# Altium schematic sheet 1_Sheet_1.schdoc.schdoc
size 426 x 302 mm; Name: A_A3; Symbol: A_A3; Device: A_A3; @Project Name: 树莓派3/4B UPS电源; REV: 1.0; Date: 2024-3-5; Sheet: 1/1; Draw By: Sitcom; Company: Your Company; Convert to PCB: yes; Add into BOM: yes
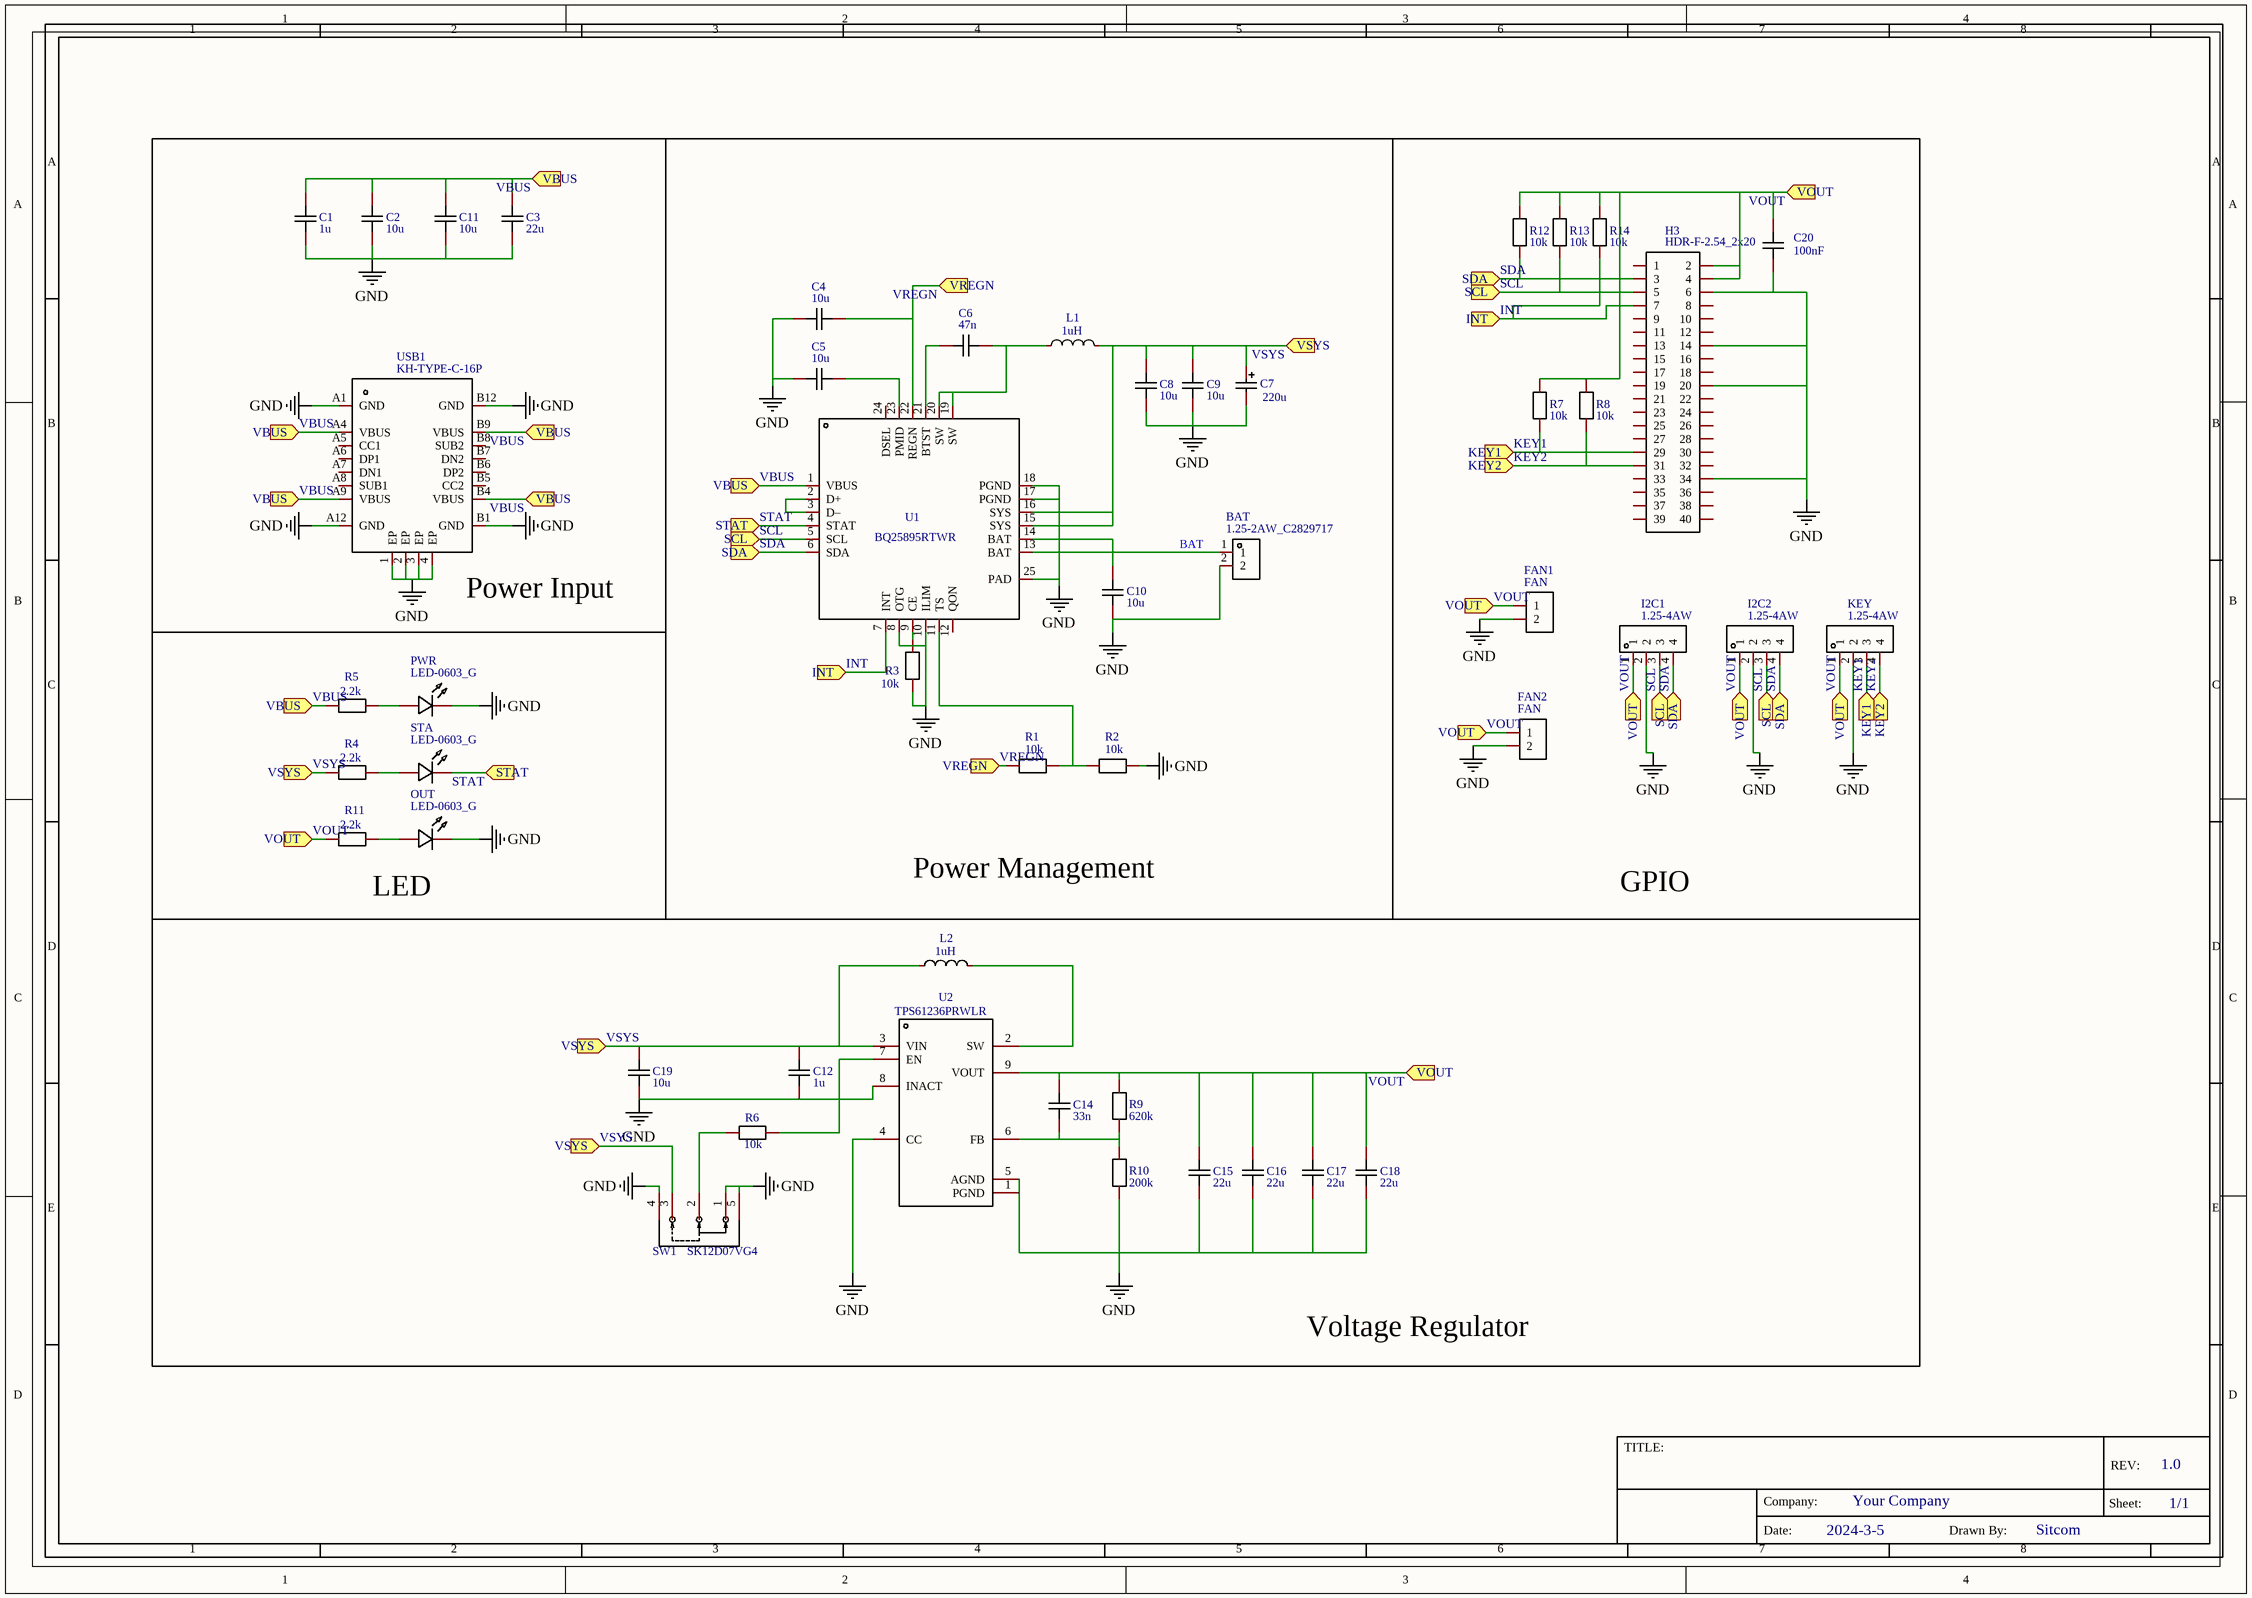
[diagram p0: 1_Sheet_1.schdoc.schdoc]

## Parts
BAT  1.25-2AW_C2829717  [CONN-TH_1.25-2AW_C2829717]
C1  1u  [C0603]
C2  10u  [C0603]
C3  22u  [C0603]
C4  10u  [C0603]
C5  10u  [C0603]
C6  47n  [C0603]
C7  220u  [CAP-SMD_L3.5-W2.8-R-RD]
C8  10u  [C0603]
C9  10u  [C0603]
C10  10u  [C0603]
C11  10u  [C0603]
C12  1u  [C0603]
C14  33n  [C0603]
C15  22u  [C0603]
C16  22u  [C0603]
C17  22u  [C0603]
C18  22u  [C0603]
C19  10u  [C0603]
C20  100nF  [C0603]
FAN1  FAN  [HDR-F-2.54_1X2]
FAN2  FAN  [HDR-F-2.54_1X2]
H3  HDR-F-2.54_2x20  [HDR-F-2.54_2X20]
I2C1  1.25-4AW  [CONN-TH_1.25-4AW]
I2C2  1.25-4AW  [CONN-TH_1.25-4AW]
KEY  1.25-4AW  [CONN-TH_1.25-4AW]
L1  1uH  [IND-SMD_L7.0-W6.6_MPCA-0630]
L2  1uH  [IND-SMD_L7.0-W6.6_MPCA-0630]
OUT  LED-0603_G  [LED0603_GREEN]
PWR  LED-0603_G  [LED0603_GREEN]
R1  10k  [R0603]
R2  10k  [R0603]
R3  10k  [R0603]
R4  2.2k  [R0603]
R5  2.2k  [R0603]
R6  10k  [R0603]
R7  10k  [R0603]
R8  10k  [R0603]
R9  620k  [R0603]
R10  200k  [R0603]
R11  2.2k  [R0603]
R12  10k  [R0603]
R13  10k  [R0603]
R14  10k  [R0603]
STA  LED-0603_G  [LED0603_GREEN]
SW1  SK12D07VG4  [SW-TH_SK12D07VG4]
U1  BQ25895RTWR  [QFN-24_L4.0-W4.0-P0.50-TL-EP2.7]
U2  TPS61236PRWLR  [VQFN-9_L2.5-W2.5-P0.50-TL]
USB1  KH-TYPE-C-16P  [USB-C-SMD_KH-TYPE-C-16P]

## Blocks framed on the sheet
Power Input: C1-C3 C11 USB1
Power Management: BAT C4-C10 L1 R1-R3 U1
GPIO: C20 FAN1 FAN2 H3 I2C1 I2C2 KEY R7 R8 R12-R14
LED: OUT PWR R4 R5 R11 STA
Voltage Regulator: C12 C14-C19 L2 R6 R9 R10 SW1 U2

## Ports
INT (in), KEY1 (in), KEY2 (in), SCL (in), SDA (in), STAT (in), VBUS (in), VOUT (in), VREGN (in), VSYS (in)

## Nets
GND: BAT.2 C1.1 C2.1 C3.1 C4.2 C5.2 C7.2 C8.1 C9.1 C10.1 C11.1 C12.1 C15.1 C16.1 C17.1 C18.1 C19.1 C20.1 FAN1.2 FAN2.2 H3.6 H3.14 H3.20 H3.34 I2C1.2 I2C2.2 KEY.2 OUT.2 PWR.2 R2.2 R3.2 R10.1 SW1.1 SW1.4 SW1.5 U1.8(OTG) U1.10(ILIM) U1.17(PGND) U1.18(PGND) U1.25(PAD) U2.1(PGND) U2.4(CC) U2.5(AGND) U2.8(INACT) USB1.1(EP) USB1.2(EP) USB1.3(EP) USB1.4(EP) USB1.A1(GND) USB1.A12(GND) USB1.B1(GND) USB1.B12(GND)
BAT: BAT.1 C10.2 U1.13(BAT) U1.14(BAT)
INT: H3.7 R14.1 U1.7(INT) ; port INT
KEY1: H3.29 KEY.3 R7.1 ; port KEY1
KEY2: H3.31 KEY.4 R8.1 ; port KEY2
SCL: H3.5 I2C1.3 I2C2.3 R13.1 U1.5(SCL) ; port SCL
SDA: H3.3 I2C1.4 I2C2.4 R12.1 U1.6(SDA) ; port SDA
STAT: STA.2 U1.4(STAT) ; port STAT
VBUS: C1.2 C2.2 C3.2 C11.2 R5.1 U1.1(VBUS) USB1.A4(VBUS) USB1.A9(VBUS) USB1.B4(VBUS) USB1.B9(VBUS) ; port VBUS
VOUT: C14.2 C15.2 C16.2 C17.2 C18.2 C20.2 FAN1.1 FAN2.1 H3.2 H3.4 I2C1.1 I2C2.1 KEY.1 R7.2 R8.2 R9.2 R11.1 R12.2 R13.2 R14.2 U2.9(VOUT) ; port VOUT
VREGN: C4.1 R1.1 U1.22(REGN) ; port VREGN
VSYS: C7.1 C8.2 C9.2 C12.2 C19.2 L1.2 L2.1 R4.1 SW1.3 U1.15(SYS) U1.16(SYS) U2.3(VIN) ; port VSYS
NetC5_1: C5.1 U1.23(PMID)
NetC6_1: C6.1 U1.21(BTST)
NetC6_2: C6.2 L1.1 U1.19(SW) U1.20(SW)
NetC14_1: C14.1 R9.1 R10.2 U2.6(FB)
NetL2_2: L2.2 U2.2(SW)
NetOUT_1: OUT.1 R11.2
NetPWR_1: PWR.1 R5.2
NetR1_2: R1.2 R2.1 U1.11(TS)
NetR3_1: R3.1 U1.9(CE)
NetR4_2: R4.2 STA.1
NetR6_1: R6.1 SW1.2
NetR6_2: R6.2 U2.7(EN)
NetU1_2: U1.2(D+) U1.3(D–)

Not connected (* = marked no-connect by the designer): H3 1 8 9 10 11 12 13 15 16 17 18 19 21 22 23 24 25 26 27 28 30 32 33 35 36 37 38 39 40; U1 12(QON) 24(DSEL); USB1 A5(CC1) A6(DP1) A7(DN1) A8(SUB1) B5(CC2) B6(DP2) B7(DN2) B8(SUB2)

## Notes on the sheet
- 1
- 2
- 3
- 4
- 5
- 6
- 7
- 8
- A
- B
- C
- D
- E
- TITLE:
- REV:
- 1.0
- Date:
- Company:
- 2024-3-5
- Your Company
- Drawn By:
- Sitcom
- Sheet:
- 1/1

## Library data of the parts
BAT = 1.25-2AW: Manufacturer: FG(富港); Convert to PCB: yes; Name: 1.25-2AW_C2829717; Symbol: 1.25-2AW_C2829717; Device: 1.25-2AW; Supplier: LCSC; Supplier Part: C2829717; Manufacturer Part: 1.25-2AW; JLCPCB Part Class: Extended Part; Add into BOM: yes; Origin Footprint: CONN-TH_1.25-2AW_C2829717
C1 C12 = 1u: Convert to PCB: yes; Name: 1u; Symbol: 1u; Device: 1u; Add into BOM: yes; Origin Footprint: C0603
C2 C4 C5 C8-C11 C19 = 10u: Convert to PCB: yes; Name: 10u; Symbol: 10u; Device: 10u; Add into BOM: yes; Origin Footprint: C0603
C3 C15-C18 = 22u: Convert to PCB: yes; Name: 22u; Symbol: 22u; Device: 22u; Add into BOM: yes; Origin Footprint: C0603
C6 = 47n: Convert to PCB: yes; Name: 47n; Symbol: 47n; Device: 47n; Add into BOM: yes; Origin Footprint: C0603
C7 = TAJB107M006RNJ: Manufacturer: AVX; Convert to PCB: yes; Name: 220u; Symbol: 220u; Device: TAJB107M006RNJ; Supplier: LCSC; Manufacturer Part: TAJB107M006RNJ; Supplier Part: C7195; JLCPCB Part Class: Extended Part; Add into BOM: yes; Origin Footprint: CAP-SMD_L3.5-W2.8-R-RD
C14 = 33n: Convert to PCB: yes; Name: 33n; Symbol: 33n; Device: 33n; Add into BOM: yes; Origin Footprint: C0603
C20 = CAP_0603: Symbol: CapAcitance; Convert to PCB: yes; Name: 100nF; Device: CAP_0603; Add into BOM: yes; Supplier Footprint: 0603; Value: 100nF
FAN1 FAN2 = FAN: Convert to PCB: yes; Name: FAN; Symbol: FAN; Device: FAN; Supplier Part: C49661; Supplier: LCSC; Add into BOM: yes; Origin Footprint: HDR-F-2.54_1X2
H3 = HDR-F-2.54_2x20: Convert to PCB: yes; Name: HDR-F-2.54_2x20; Symbol: HDR-F-2.54_2x20; Device: HDR-F-2.54_2x20; Supplier Part: C50982; Supplier: LCSC; Add into BOM: yes; Origin Footprint: HDR-F-2.54_2X20
I2C1 I2C2 KEY = 1.25-4AW: Manufacturer: CAX; Convert to PCB: yes; Name: 1.25-4AW; Symbol: 1.25-4AW; Device: 1.25-4AW; Supplier: LCSC; Supplier Part: C722602; Manufacturer Part: 1.25-4AW; JLCPCB Part Class: Extended Part; Add into BOM: yes; Origin Footprint: CONN-TH_1.25-4AW
L1 L2 = MPCA-0630-R33-M: Manufacturer: MAZO; Convert to PCB: yes; Name: 1uH; Symbol: 1uH; Device: MPCA-0630-R33-M; Supplier: LCSC; Supplier Part: C268394; Manufacturer Part: MPCA-0630-R33-M; JLCPCB Part Class: Extended Part; Add into BOM: yes; Origin Footprint: IND-SMD_L7.0-W6.6_MPCA-0630
OUT PWR STA = 19-217/GHC-YR1S2/3T: Manufacturer: EVERLIGHT(台湾亿光); Convert to PCB: yes; Name: LED-0603_G; Symbol: LED-0603_G; Device: 19-217/GHC-YR1S2/3T; Manufacturer Part: 19-217/GHC-YR1S2/3T; Supplier Part: C72043; Supplier: LCSC; Add into BOM: yes; Origin Footprint: LED0603_GREEN
R1-R3 R6-R8 R12-R14 = 10k: Convert to PCB: yes; Name: 10k; Symbol: 10k; Device: 10k; Add into BOM: yes; Origin Footprint: R0603
R4 R5 R11 = 2.2k: Convert to PCB: yes; Name: 2.2k; Symbol: 2.2k; Device: 2.2k; Add into BOM: yes; Origin Footprint: R0603
R9 = 620k: Convert to PCB: yes; Name: 620k; Symbol: 620k; Device: 620k; Add into BOM: yes; Origin Footprint: R0603
R10 = 200k: Convert to PCB: yes; Name: 200k; Symbol: 200k; Device: 200k; Add into BOM: yes; Origin Footprint: R0603
SW1 = SK12D07VG4: Manufacturer: SHOU HAN; Convert to PCB: yes; Name: SK12D07VG4; Symbol: SK12D07VG4; Device: SK12D07VG4; Supplier: LCSC; Supplier Part: C393937; Manufacturer Part: SK12D07VG4; JLCPCB Part Class: Extended Part; Add into BOM: yes; Origin Footprint: SW-TH_SK12D07VG4
U1 = BQ25895RTWR: Manufacturer: TI; Convert to PCB: yes; Name: BQ25895RTWR; Symbol: BQ25895RTWR; Device: BQ25895RTWR; Supplier: LCSC; Manufacturer Part: BQ25895RTWR; Supplier Part: C80200; JLCPCB Part Class: Extended Part; Add into BOM: yes; Origin Footprint: QFN-24_L4.0-W4.0-P0.50-TL-EP2.7
U2 = TPS61236PRWLR: Manufacturer: TI; Convert to PCB: yes; Name: TPS61236PRWLR; Symbol: TPS61236PRWLR; Device: TPS61236PRWLR; Supplier: LCSC; Manufacturer Part: TPS61236PRWLR; Supplier Part: C130295; JLCPCB Part Class: Extended Part; Add into BOM: yes; Origin Footprint: VQFN-9_L2.5-W2.5-P0.50-TL
USB1 = KH-TYPE-C-16P: Manufacturer: Shenzhen Kinghelm Elec; Convert to PCB: yes; Name: KH-TYPE-C-16P; Symbol: KH-TYPE-C-16P; Device: KH-TYPE-C-16P; Supplier: LCSC; Supplier Part: C709357; Manufacturer Part: KH-TYPE-C-16P; JLCPCB Part Class: Extended Part; Add into BOM: yes; Origin Footprint: USB-C-SMD_KH-TYPE-C-16P